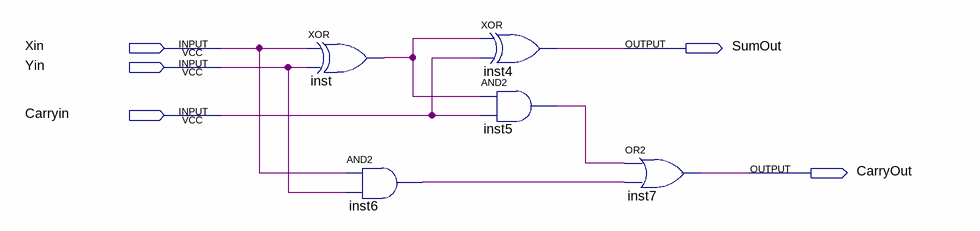
[diagram p0: schematic sheet]
// Quartus schematic fulladder1bit.bdf as structural Verilog: 5 symbols, 5 pins
module fulladder1bit (
  input  Xin,
  input  Yin,
  input  Carryin,
  output SumOut,
  output CarryOut
);

  wire inst5_out, inst6_out, inst_out;

  xor inst (inst_out, Xin, Yin);
  and inst6 (inst6_out, Xin, Yin);
  xor inst4 (SumOut, inst_out, Carryin);
  and inst5 (inst5_out, inst_out, Carryin);
  or inst7 (CarryOut, inst5_out, inst6_out);
endmodule
